# Altium schematic sheet midi_output.SchDoc
size A4; Organization: Altium Limited; Address1: L3, 12a Rodborough Rd; Address2: Frenchs Forest; Address3: NSW; Address4: Australia 2086
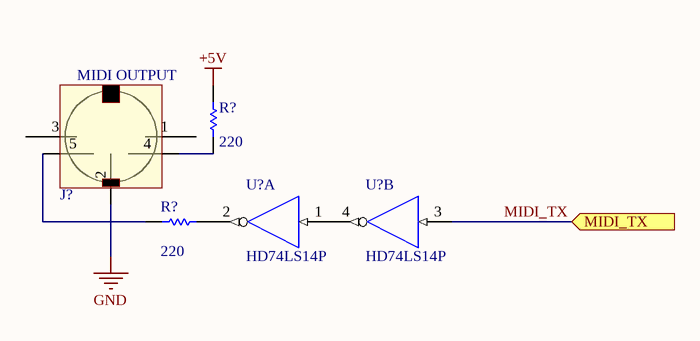
[diagram p0: midi_output.SchDoc]

## Parts
(Parts that share a designator on the sheet are numbered #1, #2 ... from top to bottom, then left to right.)
J?  MIDI OUTPUT  [SDS-50J]
R?#1  value 220  [AXIAL-0.3]
R?#2  value 220  [AXIAL-0.3]
U?#1  HD74LS14P  [PRDP0014AB-B]  (part A of 6)
U?#2  HD74LS14P  [PRDP0014AB-B]  (part B of 6)

## Ports
MIDI_TX (in)

## Nets
+5V: R?#1.2
GND: J?.2
MIDI_TX: U?#2.3(2A) ; port MIDI_TX
NetJ?_4: J?.4 R?#1.1
NetJ?_5: J?.5 R?#2.2
NetR?#2_1: R?#2.1 U?#1.2(1~{Y})
NetU?#1_1: U?#1.1(1A) U?#2.4(2~{Y})

Not connected (* = marked no-connect by the designer): J? 1 3; U?#1 7(GND) 14(VCC); U?#2 7(GND) 14(VCC)

## Notes on the sheet
- Title
- Size:
- Date:
- A4
- Number:
- Time:
- Revision:
- Sheet
- of
- File:

## Library data of the parts
J? = SDS-50J: Right-Angle Female MIDI Connector; Manufacturer: CUI Inc; Connector Type: Receptacle, Female Sockets; Number of Positions: 5; Current Rating: 2A, 1A; Voltage - Rated: 100VAC, 24VDC; Supplier 1: Digi-Key; Manufacturer Part Number: SDS-50J; RoHS: RoHS Compliant; Category: Connectors, Interconnects; Stock 1: 34152; Pricing 1: 1=1.05, 10=0.814, 100=0.621, 500=0.4968, 1000=0.4416, 2500=0.36708 (USD); Packaging: Bulk; Shell Size - Insert: DIN (180 Degree); Shell Size, MIL: -; Mounting Type: Through Hole, Right Angle; Termination: Solder; Fastening Type: Push-Pull; Orientation: Keyed; Ingress Protection: -; Shell Material, Finish: Polybutylene Terephthalate (PBT); Contact Finish: Tin; Features: -; Contact Finish Thickness: -; Operating Temperature: -40°C ~ 85°C; ComponentLink1URL: http://www.cui.com/product/resource/digikeypdf/sds-xxj.pdf; ComponentLink1Description: http://www.cui.com/product/resource/digikeypdf/sds-xxj.pdf
R?#1 R?#2 = Res1: Resistor; Published: 8-Jun-2000; LatestRevisionDate: 17-Jul-2002; LatestRevisionNote: Re-released for DXP Platform.; PackageReference: AXIAL-0.3; Publisher: Altium Limited; PackageDescription: Axial Device, Thru-Hole; 2 Leads; 0.3 in Pin Spacing
U?#1 U?#2 = HD74LS14P: Hex Schmitt Trigger Inverters; Published: 10-Feb-2010; DatasheetVersion: Rev.4.00, Apr-2009; PackageVersion: Sep-2005; PackageReference: PRDP0014AB-B; Publisher: Altium Limited; PackageDescription: 14-Pin Plastic DIP, 19.2 x 6.3 mm Body, 7.62 mm Row Spacing, Pitch 2.54 mm; Code_JEITA: P-DIP14-6.3x19.2-2.54; ComponentLink1Description: Manufacturer Link; ComponentLink1URL: http://sg.renesas.com/fmwk.jsp?cnt=hd74ls_root.jsp&fp=/products/standard_ic/general_purpose_logic/5v_standard_logic/hd74ls/; ComponentLink2Description: Datasheet; ComponentLink2URL: http://documentation.renesas.com/eng/products/logic/rej03d0399_hd74ls14.pdf; ComponentLink3Description: Packaging Specification; ComponentLink3URL: http://sg.renesas.com/media/products/common_info/package/pdf/ic/code/prdp0014ab_b.pdf